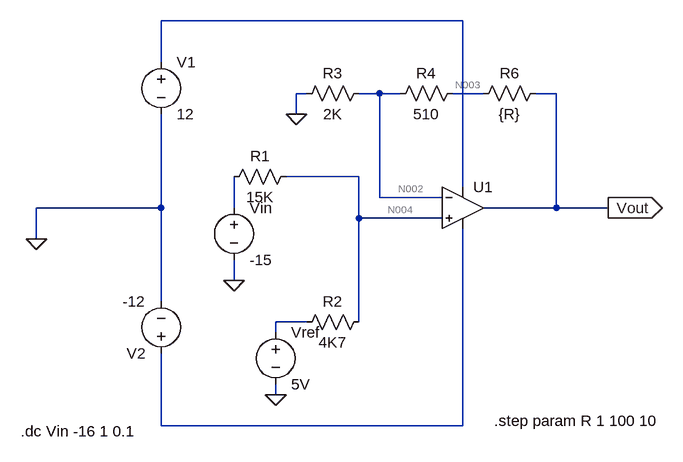
[diagram p0: schematic v-measure-opamp3.asc]
v-measure-opamp3.asc, the LTspice schematic file:
Version 4
SHEET 1 880 680
WIRE 496 32 32 32
WIRE 32 96 32 32
WIRE 256 144 240 144
WIRE 368 144 336 144
WIRE 400 144 368 144
WIRE 528 144 480 144
WIRE 640 144 608 144
WIRE 240 176 240 144
WIRE 336 272 224 272
WIRE 496 288 496 32
WIRE 368 304 368 144
WIRE 464 304 368 304
WIRE 32 320 32 176
WIRE 32 320 -160 320
WIRE 144 320 144 272
WIRE 640 320 640 144
WIRE 640 320 528 320
WIRE 720 320 640 320
WIRE 336 336 336 272
WIRE 464 336 336 336
WIRE -160 368 -160 320
WIRE 144 432 144 400
WIRE 32 464 32 320
WIRE 256 496 208 496
WIRE 336 496 336 336
WIRE 208 512 208 496
WIRE 208 608 208 592
WIRE 32 656 32 544
WIRE 496 656 496 352
WIRE 496 656 32 656
FLAG -160 368 0
FLAG 144 432 0
FLAG 208 608 0
FLAG 240 176 0
FLAG 720 320 Vout
IOPIN 720 320 Out
SYMBOL voltage 32 80 R0
WINDOW 123 0 0 Left 2
WINDOW 39 0 0 Left 2
SYMATTR InstName V1
SYMATTR Value 12
SYMBOL voltage 32 560 R180
WINDOW 123 0 0 Left 2
WINDOW 39 0 0 Left 2
SYMATTR InstName V2
SYMATTR Value -12
SYMBOL voltage 144 304 R0
SYMATTR InstName Vin
SYMATTR Value -15
SYMBOL Opamps\\UniversalOpamp2 496 320 R0
SYMATTR InstName U1
SYMBOL res 240 256 R90
WINDOW 0 0 56 VBottom 2
WINDOW 3 32 56 VTop 2
SYMATTR InstName R1
SYMATTR Value 15K
SYMBOL res 352 480 R90
WINDOW 0 0 56 VBottom 2
WINDOW 3 32 56 VTop 2
SYMATTR InstName R2
SYMATTR Value 4K7
SYMBOL voltage 208 496 R0
SYMATTR InstName Vref
SYMATTR Value 5V
SYMBOL res 352 128 R90
WINDOW 0 0 56 VBottom 2
WINDOW 3 32 56 VTop 2
SYMATTR InstName R3
SYMATTR Value 2K
SYMBOL res 496 128 R90
WINDOW 0 0 56 VBottom 2
WINDOW 3 32 56 VTop 2
SYMATTR InstName R4
SYMATTR Value 510
SYMBOL res 624 128 R90
WINDOW 0 0 56 VBottom 2
WINDOW 3 32 56 VTop 2
SYMATTR InstName R6
SYMATTR Value {R}
TEXT -184 664 Left 2 !.dc Vin -16 1 0.1
TEXT 544 648 Left 2 !.step param R 1 100 10

The netlist it stands for:
* v-measure-opamp3.asc
V1 N001 0 12
V2 N007 0 -12
Vin N005 0 -15
XU1 N004 N002 N001 N007 Vout level.2 Avol=1Meg GBW=10Meg Slew=10Meg ilimit=25m rail=0 Vos=0 phimargin=45 en=0 enk=0 in=0 ink=0 Rin=500Meg  ; pins IN+ IN- V+ V- OUT
R1 N004 N005 15K
R2 N004 N006 4K7
Vref N006 0 5V
R3 N002 0 2K
R4 N003 N002 510
R6 Vout N003 {R}
.dc Vin -16 1 0.1
.step param R 1 100 10
.lib UniversalOpamps2.sub
.backanno
.end

* Results of the author's LTspice run, read from the files saved beside the schematic
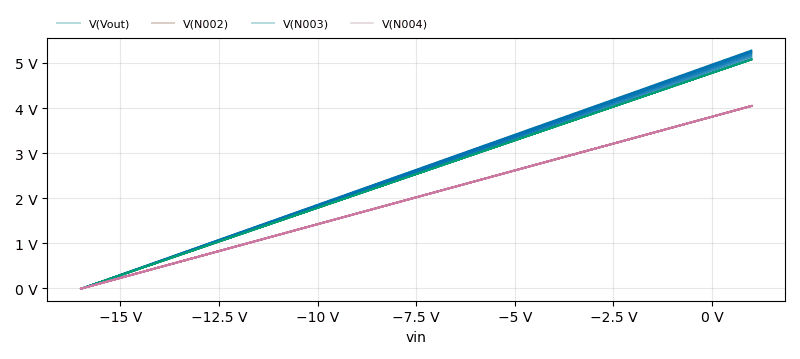
[diagram p1: DC transfer characteristic of v-measure-opamp3.asc, plotted from the saved traces]
* DC transfer characteristic, 21 runs:
*   V(Vout) [run 1]: -12.75 mV at vin=-16 V, 5.079 V at vin=1 V, min -12.75 mV, max 5.079 V
*   V(Vout) [run 2]: -12.8 mV at vin=-16 V, -12.8 mV at vin=-16 V, min -12.8 mV, max -12.8 mV
*   V(Vout) [run 3]: -12.8 mV at vin=-16 V, 5.1 V at vin=1 V, min -12.8 mV, max 5.1 V
*   V(Vout) [run 4]: -12.85 mV at vin=-16 V, 5.12 V at vin=1 V, min -12.85 mV, max 5.12 V
*   V(Vout) [run 5]: -12.9 mV at vin=-16 V, -12.9 mV at vin=-16 V, min -12.9 mV, max -12.9 mV
*   V(Vout) [run 6]: -12.9 mV at vin=-16 V, 5.14 V at vin=1 V, min -12.9 mV, max 5.14 V
*   V(Vout) [run 7]: -12.95 mV at vin=-16 V, 5.16 V at vin=1 V, min -12.95 mV, max 5.16 V
*   V(Vout) [run 8]: -13 mV at vin=-16 V, -13 mV at vin=-16 V, min -13 mV, max -13 mV
*   V(N002) [run 1]: -10.15 mV at vin=-16 V, 4.046 V at vin=1 V, min -10.15 mV, max 4.046 V
*   V(N002) [run 2]: -10.15 mV at vin=-16 V, -10.15 mV at vin=-16 V, min -10.15 mV, max -10.15 mV
*   V(N002) [run 3]: -10.15 mV at vin=-16 V, 4.046 V at vin=1 V, min -10.15 mV, max 4.046 V
*   V(N002) [run 4]: -10.15 mV at vin=-16 V, 4.046 V at vin=1 V, min -10.15 mV, max 4.046 V
*   V(N002) [run 5]: -10.15 mV at vin=-16 V, -10.15 mV at vin=-16 V, min -10.15 mV, max -10.15 mV
*   V(N002) [run 6]: -10.15 mV at vin=-16 V, 4.046 V at vin=1 V, min -10.15 mV, max 4.046 V
*   V(N002) [run 7]: -10.15 mV at vin=-16 V, 4.046 V at vin=1 V, min -10.15 mV, max 4.046 V
*   V(N002) [run 8]: -10.15 mV at vin=-16 V, -10.15 mV at vin=-16 V, min -10.15 mV, max -10.15 mV
*   V(N003) [run 1]: -12.74 mV at vin=-16 V, 5.077 V at vin=1 V, min -12.74 mV, max 5.077 V
*   V(N003) [run 2]: -12.74 mV at vin=-16 V, -12.74 mV at vin=-16 V, min -12.74 mV, max -12.74 mV
*   V(N003) [run 3]: -12.74 mV at vin=-16 V, 5.077 V at vin=1 V, min -12.74 mV, max 5.077 V
*   V(N003) [run 4]: -12.74 mV at vin=-16 V, 5.077 V at vin=1 V, min -12.74 mV, max 5.077 V
*   V(N003) [run 5]: -12.74 mV at vin=-16 V, -12.74 mV at vin=-16 V, min -12.74 mV, max -12.74 mV
*   V(N003) [run 6]: -12.74 mV at vin=-16 V, 5.077 V at vin=1 V, min -12.74 mV, max 5.077 V
*   V(N003) [run 7]: -12.74 mV at vin=-16 V, 5.077 V at vin=1 V, min -12.74 mV, max 5.077 V
*   V(N003) [run 8]: -12.74 mV at vin=-16 V, -12.74 mV at vin=-16 V, min -12.74 mV, max -12.74 mV
*   V(N004) [run 1]: -10.15 mV at vin=-16 V, 4.046 V at vin=1 V, min -10.15 mV, max 4.046 V
*   V(N004) [run 2]: -10.15 mV at vin=-16 V, -10.15 mV at vin=-16 V, min -10.15 mV, max -10.15 mV
*   V(N004) [run 3]: -10.15 mV at vin=-16 V, 4.046 V at vin=1 V, min -10.15 mV, max 4.046 V
*   V(N004) [run 4]: -10.15 mV at vin=-16 V, 4.046 V at vin=1 V, min -10.15 mV, max 4.046 V
*   V(N004) [run 5]: -10.15 mV at vin=-16 V, -10.15 mV at vin=-16 V, min -10.15 mV, max -10.15 mV
*   V(N004) [run 6]: -10.15 mV at vin=-16 V, 4.046 V at vin=1 V, min -10.15 mV, max 4.046 V
*   V(N004) [run 7]: -10.15 mV at vin=-16 V, 4.046 V at vin=1 V, min -10.15 mV, max 4.046 V
*   V(N004) [run 8]: -10.15 mV at vin=-16 V, -10.15 mV at vin=-16 V, min -10.15 mV, max -10.15 mV